# EAGLE design untitled (EAGLE 7.2.0)
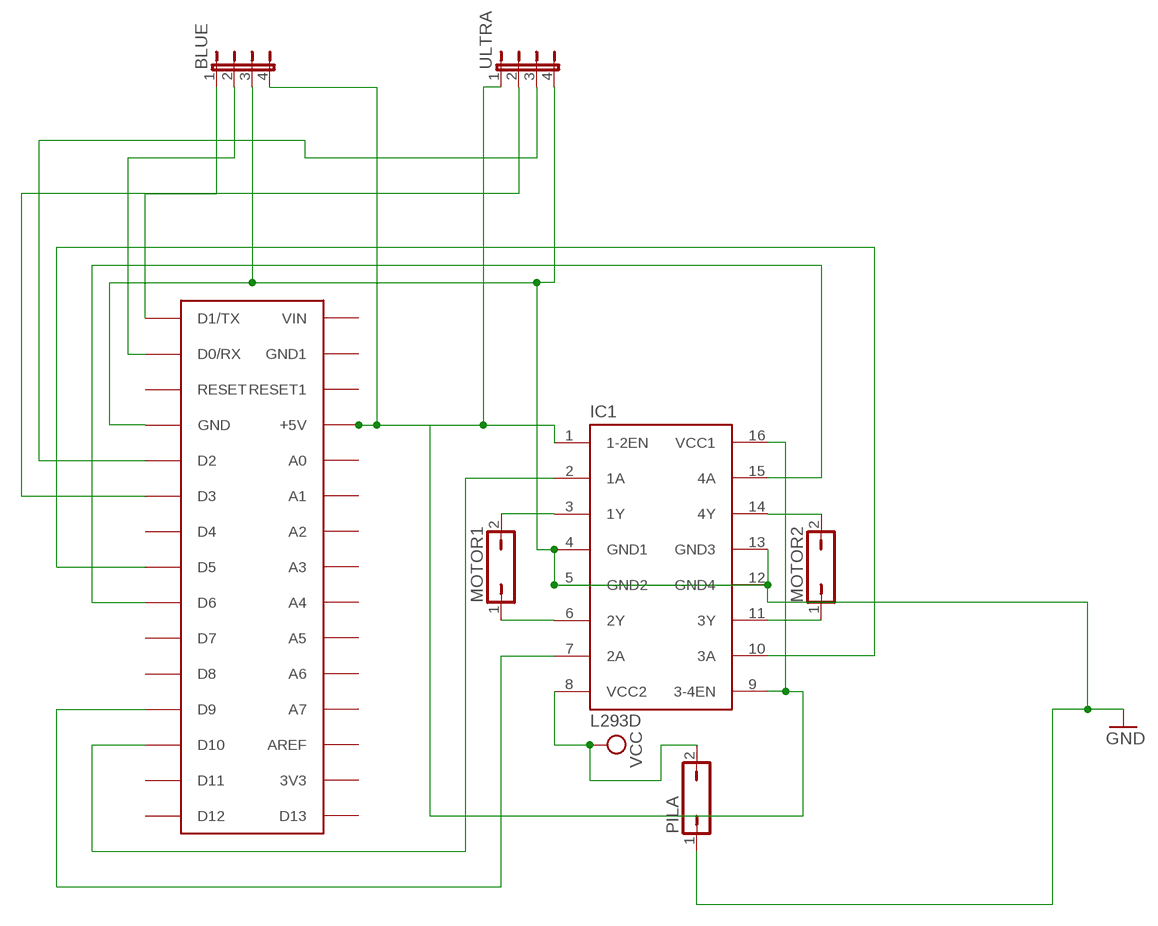
[diagram p0: schematic, sheet 1]

## Parts
BLUE  JP4E  [JP4]
IC1  L293D  [DIL16]
MOTOR1  JP1Q  [JP1]
MOTOR2  JP1Q  [JP1]
PILA  JP1Q  [JP1]
U$1  ARDUINONANO  [PDIP-32]
ULTRA  JP4E  [JP4]

## Nets
GND: BLUE.3 IC1.4(GND1) IC1.5(GND2) IC1.12(GND4) IC1.13(GND3) PILA.1 U$1.GND ULTRA.4
N$1: IC1.10(3A) U$1.D5
N$2: IC1.15(4A) U$1.D6
N$3: IC1.7(2A) U$1.D9
N$4: IC1.2(1A) U$1.D10
N$5: BLUE.4 IC1.1(1-2EN) IC1.9(3-4EN) IC1.16(VCC1) U$1.+5V ULTRA.1
N$6: BLUE.2 U$1.D0/RX
N$7: BLUE.1 U$1.D1/TX
N$8: IC1.3(1Y) MOTOR1.2
N$9: U$1.D3 ULTRA.2
N$10: U$1.D2 ULTRA.3
N$11: IC1.6(2Y) MOTOR1.1
N$12: IC1.11(3Y) MOTOR2.1
N$13: IC1.14(4Y) MOTOR2.2
VCC: IC1.8(VCC2) PILA.2
Unconnected: U$1.3V3 U$1.A0 U$1.A1 U$1.A2 U$1.A3 U$1.A4 U$1.A5 U$1.A6 U$1.A7 U$1.AREF U$1.D4 U$1.D7 U$1.D8 U$1.D11 U$1.D12 U$1.D13 U$1.GND1 U$1.RESET U$1.RESET1 U$1.VIN

## Library data of the parts
BLUE ULTRA = jumper:JP4E: JUMPER
IC1 = st-microelectronics:L293D: PUSH-PULL 4 CHANNEL DRIVER; MPN: L293D; OC_FARNELL: 9589619; OC_NEWARK: 56P8249
MOTOR1 MOTOR2 PILA = jumper:JP1Q: JUMPER
U$1 = jet-lib:ARDUINONANO

## Board
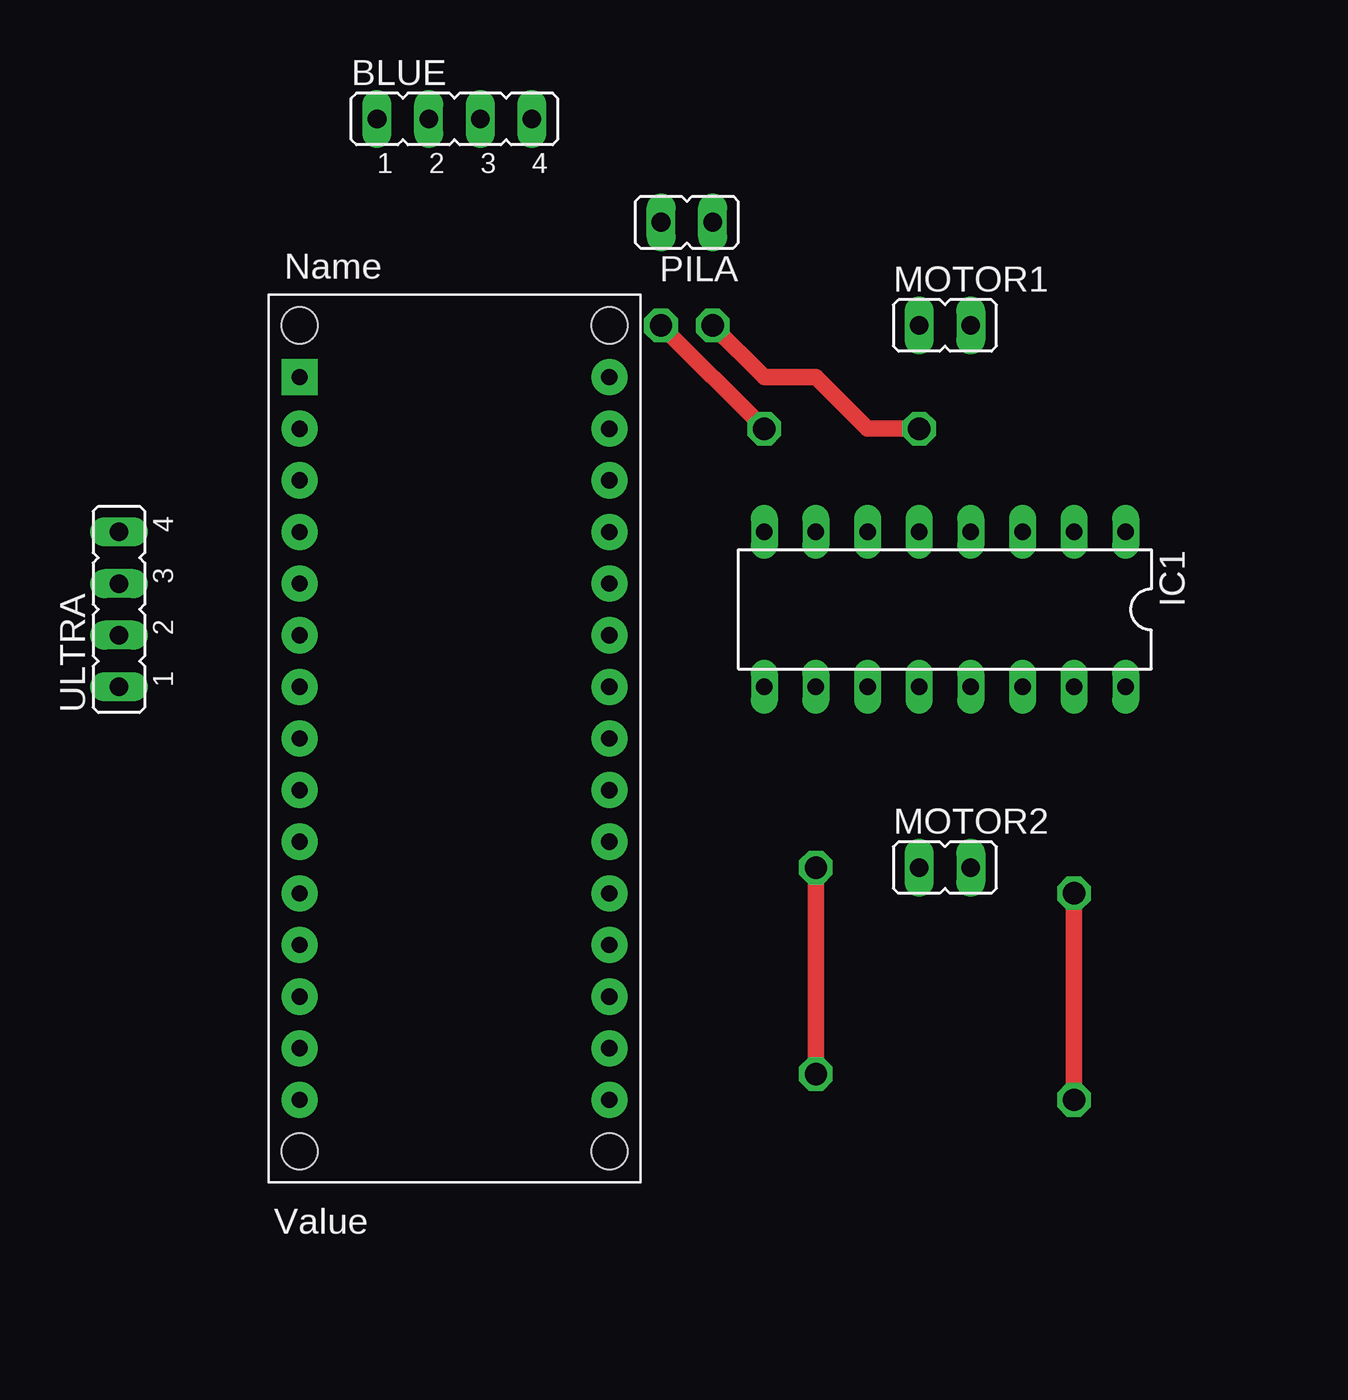
[diagram p1: board, top side]
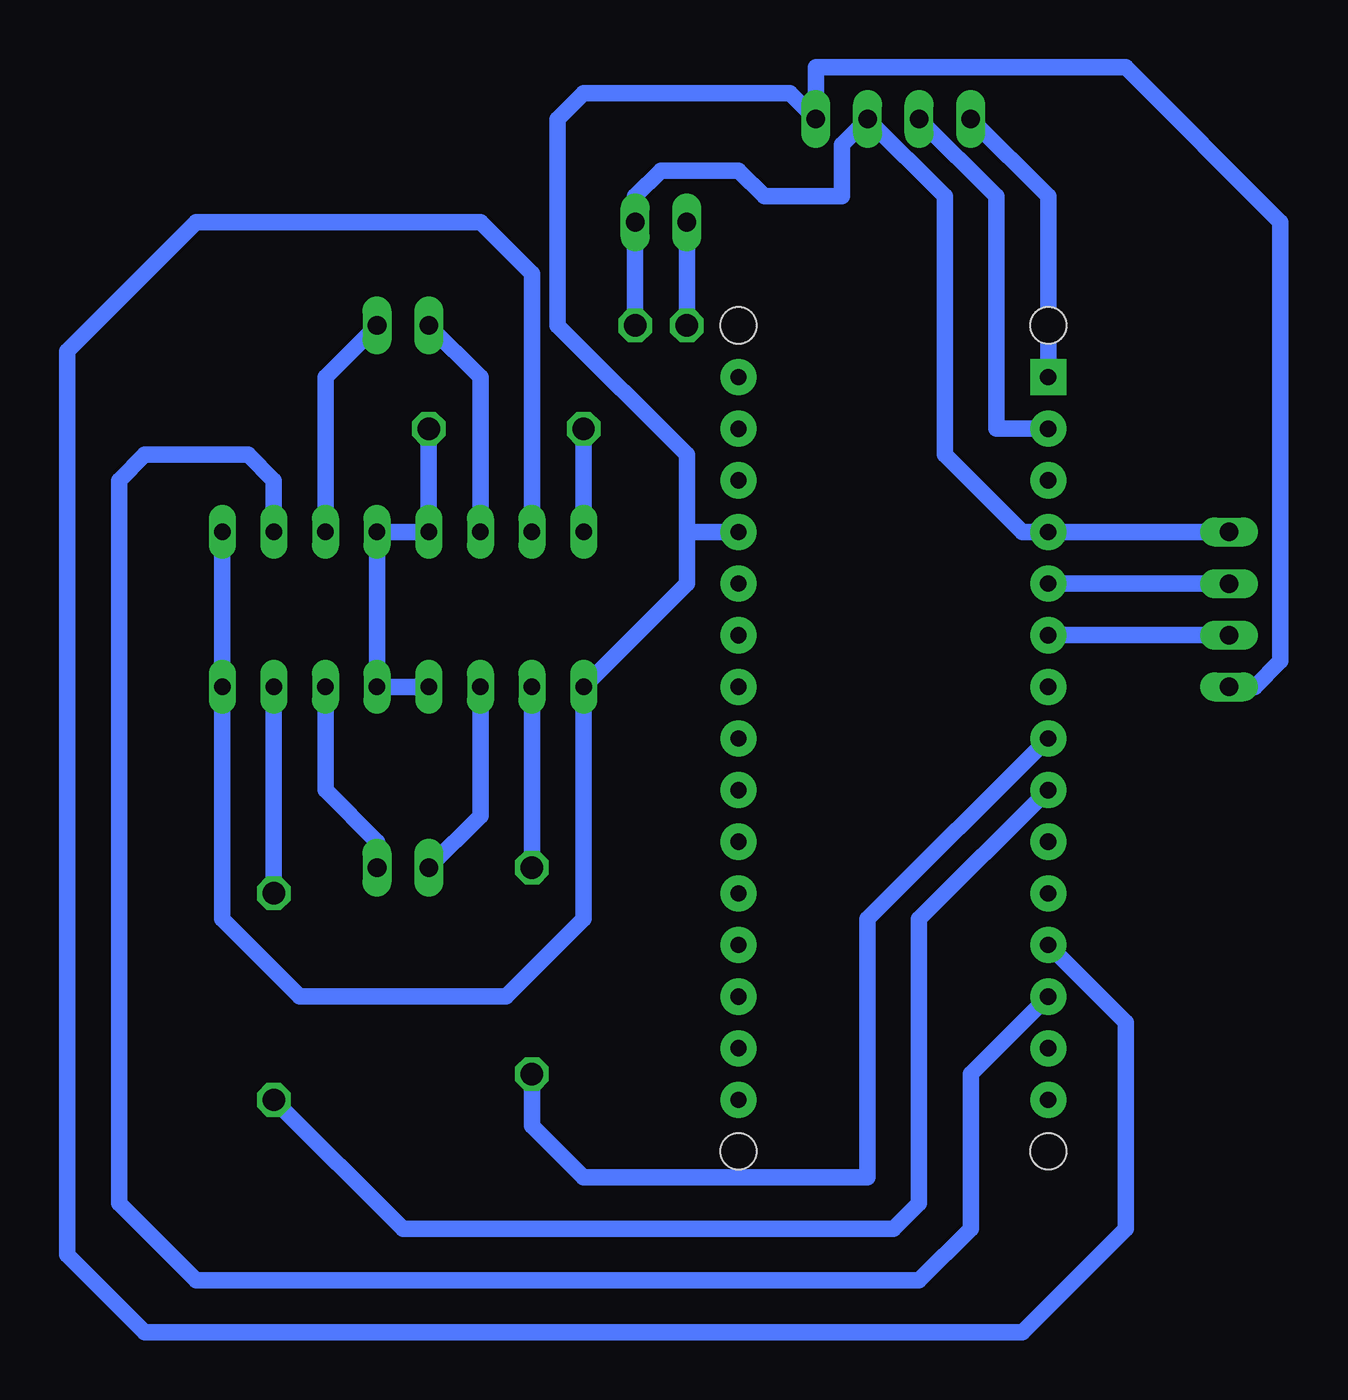
[diagram p2: board, bottom side, seen from below]

No outline drawn. Coordinates in mm, seen from the top.
Copper layers (1*16): Top 0.035mm / dielectric 1.5mm / Bottom 0.035mm
Design rules "default": minimum track width 10mil, minimum drill 24mil, track to track 8mil, track to pad 8mil, pad to pad 8mil, via to via 8mil, smd to smd 8mil, copper to edge 40mil, drill to drill 8mil, minimum pad ring 10mil, minimum via ring 8mil, stop-mask expansion 4mil, vias tented up to drill 0mil, thermal gap 10mil

### Footprints (pad centres in the part's own frame; a part is rotated, then mirrored left to right if it is on the bottom)
JP4 = drill 0.914 long: 1 -3.81,0; 2 -1.27,0; 3 1.27,0; 4 3.81,0
DIL16 = drill 0.813 long: 1 -8.89,-3.81; 2 -6.35,-3.81; 3 -3.81,-3.81; 4 -1.27,-3.81; 5 1.27,-3.81; 6 3.81,-3.81; 7 6.35,-3.81; 8 8.89,-3.81; 9 8.89,3.81; 10 6.35,3.81; 11 3.81,3.81; 12 1.27,3.81; 13 -1.27,3.81; 14 -3.81,3.81; 15 -6.35,3.81; 16 -8.89,3.81
JP1 = drill 0.914 long: 1 0,-1.27; 2 0,1.27
PDIP-32 = drill 0.8 pad 1.778: 3V3 15.24,-35.56; +5V 15.24,-10.16; A0 15.24,-12.7; A1 15.24,-15.24; A2 15.24,-17.78; A3 15.24,-20.32; A4 15.24,-22.86; A5 15.24,-25.4; A6 15.24,-27.94; A7 15.24,-30.48; AREF 15.24,-33.02; D0/RX 0,-5.08; D2 0,-12.7; D3 0,-15.24; D4 0,-17.78; D5 0,-20.32; D6 0,-22.86; D7 0,-25.4; D8 0,-27.94; D9 0,-30.48; D10 0,-33.02; D11 0,-35.56; D12 0,-38.1; D13 15.24,-38.1; GND 0,-10.16; GND1 15.24,-5.08; RESET 0,-7.62; RESET1 15.24,-7.62; VIN 15.24,-2.54 | drill 0.8 pad 1.778 square: D1/TX 0,-2.54 | hole 1.778: 0,0; 0,-40.64; 15.24,-40.64; 15.24,0

### Placement (x,y rotation side)
BLUE  20.32,58.42 0 top
IC1  44.45,34.29 180 top
MOTOR1  44.45,48.26 270 top
MOTOR2  44.45,21.59 270 top
PILA  31.75,53.34 90 top
U$1  12.7,48.26 0 top
ULTRA  3.81,34.29 90 top

### Tracks (layer width: path | path; a pad name or v marks a point on that pad's centre or on a via)
GND  (via drill 1.1)
  Top 0.813: v33.02,48.26 35.56,45.72 38.1,45.72 40.64,43.18 v43.18,43.18
  Bottom 0.813: ULTRA.4 U$1.GND 13.97,38.1 17.78,41.91 17.78,54.61 BLUE.3 22.86,57.15 22.86,54.61 26.67,54.61 27.94,55.88 31.75,55.88 33.02,54.61 PILA.1 v33.02,48.26 | IC1.12 IC1.13 IC1.4 IC1.5 v43.18,43.18
N$1  (via drill 1.1)
  Top 0.813: v38.1,21.59 v38.1,11.43
  Bottom 0.813: IC1.10 v38.1,21.59 | U$1.D5 21.59,19.05 21.59,6.35 35.56,6.35 38.1,8.89 v38.1,11.43
N$2  (via drill 1.1)
  Top 0.813: v50.8,20.32 v50.8,10.16
  Bottom 0.813: IC1.15 v50.8,20.32 | U$1.D6 19.05,19.05 19.05,5.08 20.32,3.81 44.45,3.81 v50.8,10.16
N$3
  Bottom 0.813: U$1.D9 8.89,13.97 8.89,3.81 13.97,-1.27 57.15,-1.27 60.96,2.54 60.96,46.99 54.61,53.34 40.64,53.34 38.1,50.8 IC1.7
N$4
  Bottom 0.813: U$1.D10 16.51,11.43 16.51,3.81 19.05,1.27 54.61,1.27 58.42,5.08 58.42,40.64 57.15,41.91 52.07,41.91 50.8,40.64 IC1.2
N$5
  Bottom 0.813: ULTRA.1 2.54,30.48 1.27,31.75 1.27,53.34 8.89,60.96 24.13,60.96 BLUE.4 25.4,59.69 35.56,59.69 36.83,58.42 36.83,48.26 30.48,41.91 30.48,38.1 | 30.48,38.1 U$1.+5V | IC1.1 IC1.16 53.34,19.05 49.53,15.24 39.37,15.24 35.56,19.05 IC1.9 30.48,35.56 30.48,38.1
N$6
  Bottom 0.813: BLUE.2 15.24,54.61 15.24,43.18 U$1.D0/RX
N$7
  Bottom 0.813: BLUE.1 12.7,54.61 U$1.D1/TX
N$8
  Bottom 0.813: MOTOR1.2 48.26,45.72 IC1.3
N$9
  Bottom 0.813: ULTRA.2 U$1.D3
N$10
  Bottom 0.813: ULTRA.3 U$1.D2
N$11
  Bottom 0.813: MOTOR1.1 40.64,45.72 IC1.6
N$12
  Bottom 0.813: IC1.11 40.64,24.13 MOTOR2.1
N$13
  Bottom 0.813: IC1.14 48.26,25.4 45.72,22.86 MOTOR2.2
VCC  (via drill 1.1)
  Top 0.813: v30.48,48.26 v35.56,43.18
  Bottom 0.813: IC1.8 v35.56,43.18 | PILA.2 v30.48,48.26